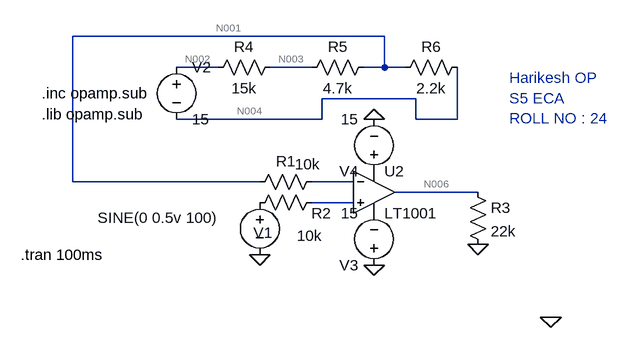
[diagram p0: schematic COMPARITOR.asc]
COMPARITOR.asc, the LTspice schematic file:
Version 4
SHEET 1 880 680
WIRE 320 -48 -160 -48
WIRE 64 0 0 0
WIRE 208 0 144 0
WIRE 320 0 320 -48
WIRE 320 0 288 0
WIRE 352 0 320 0
WIRE 368 48 224 48
WIRE 224 80 224 48
WIRE 224 80 0 80
WIRE 368 80 368 48
WIRE 432 80 432 0
WIRE 432 80 368 80
WIRE -160 176 -160 -48
WIRE 128 176 -160 176
WIRE 272 176 208 176
WIRE 464 192 336 192
WIRE 272 208 208 208
FLAG 576 384 0
FLAG 464 272 0
FLAG 128 288 0
FLAG 304 304 0
FLAG 304 80 0
SYMBOL voltage 128 192 R0
WINDOW 123 0 0 Left 0
WINDOW 39 0 0 Left 0
WINDOW 0 -10 62 Left 2
WINDOW 3 -250 39 Left 2
SYMATTR InstName V1
SYMATTR Value SINE(0 0.5v 100)
SYMBOL res 224 160 R90
WINDOW 0 0 56 VBottom 2
WINDOW 3 -27 22 VTop 2
SYMATTR InstName R1
SYMATTR Value 10k
SYMBOL res 224 192 R90
WINDOW 0 48 1 VBottom 2
WINDOW 3 51 19 VTop 2
SYMATTR InstName R2
SYMATTR Value 10k
SYMBOL res 448 176 R0
SYMATTR InstName R3
SYMATTR Value 22k
SYMBOL voltage 0 -16 R0
SYMATTR InstName V2
SYMATTR Value 15
SYMBOL res 160 -16 R90
WINDOW 0 0 56 VBottom 2
WINDOW 3 32 56 VTop 2
SYMATTR InstName R4
SYMATTR Value 15k
SYMBOL res 304 -16 R90
WINDOW 0 0 56 VBottom 2
WINDOW 3 32 56 VTop 2
SYMATTR InstName R5
SYMATTR Value 4.7k
SYMBOL res 448 -16 R90
WINDOW 0 0 56 VBottom 2
WINDOW 3 32 56 VTop 2
SYMATTR InstName R6
SYMATTR Value 2.2k
SYMBOL voltage 304 320 R180
WINDOW 123 0 0 Left 0
WINDOW 39 0 0 Left 0
SYMATTR InstName V3
SYMATTR Value 15
SYMBOL voltage 304 176 R180
WINDOW 123 0 0 Left 0
WINDOW 39 0 0 Left 0
SYMATTR InstName V4
SYMATTR Value 15
SYMBOL OpAmps\\LT1001 304 128 R0
SYMATTR InstName U2
TEXT -208 40 Left 2 !.inc opamp.sub
TEXT 512 16 Left 2 ;Harikesh OP\nS5 ECA \nROLL NO : 24
TEXT -240 288 Left 2 !.tran 100ms
TEXT -208 72 Left 2 !.lib opamp.sub

The netlist it stands for:
* COMPARITOR.asc
V1 P001 0 SINE(0 0.5v 100)
R1 N005 N001 10k
R2 N007 P001 10k
R3 N006 0 22k
V2 N002 N004 15
R4 N003 N002 15k
R5 N001 N003 4.7k
R6 N004 N001 2.2k
V3 0 P002 15
V4 P003 0 15
XU2 N007 N005 P003 P002 N006 LT1001  ; pins In+ In- V+ V- OUT
.inc opamp.sub
* Harikesh OP
* S5 ECA
* ROLL NO : 24
.tran 100ms
.lib opamp.sub
.lib LTC.lib
.backanno
.end

* Results of the author's LTspice run, read from the files saved beside the schematic
* Operating Point, zero values left out:
*   V(n006) = -5.984 µV
*   V(n002) = 13.49 V
*   V(n004) = -1.507 V
*   V(n003) = 3.219 V
*   V(p002) = -15 V
*   V(p003) = 15 V
*   I(R3) = -272 pA
*   I(R4) = -684.9 µA
*   I(R5) = -684.9 µA
*   I(R6) = -684.9 µA
*   I(V2) = -684.9 µA
*   I(V3) = -2.25 mA
*   I(V4) = -2.25 mA
*   Ix(u2:3) = 2.25 mA
*   Ix(u2:4) = -2.25 mA
*   Ix(u2:5) = 272 pA
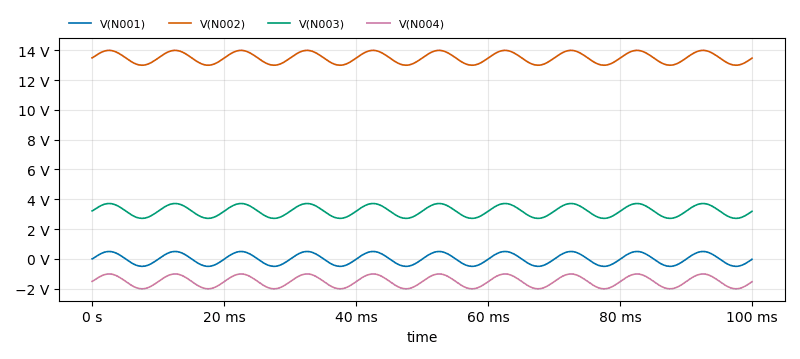
[diagram p1: Transient Analysis of COMPARITOR.asc, plotted from the saved traces]
* Transient Analysis, 1 run:
*   V(N001): min -497.8 mV, max 497.8 mV, average 16.35 µV, rms 352.2 mV, last -23.07 mV
*   V(N002): min 12.99 V, max 13.99 V, average 13.49 V, rms 13.5 V, last 13.47 V
*   V(N003): min 2.721 V, max 3.717 V, average 3.219 V, rms 3.238 V, last 3.196 V
*   V(N004): min -2.005 V, max -1.009 V, average -1.507 V, rms 1.548 V, last -1.53 V